# EAGLE design Bpod_RasPi_Shim_r1 (EAGLE 9.3.1)
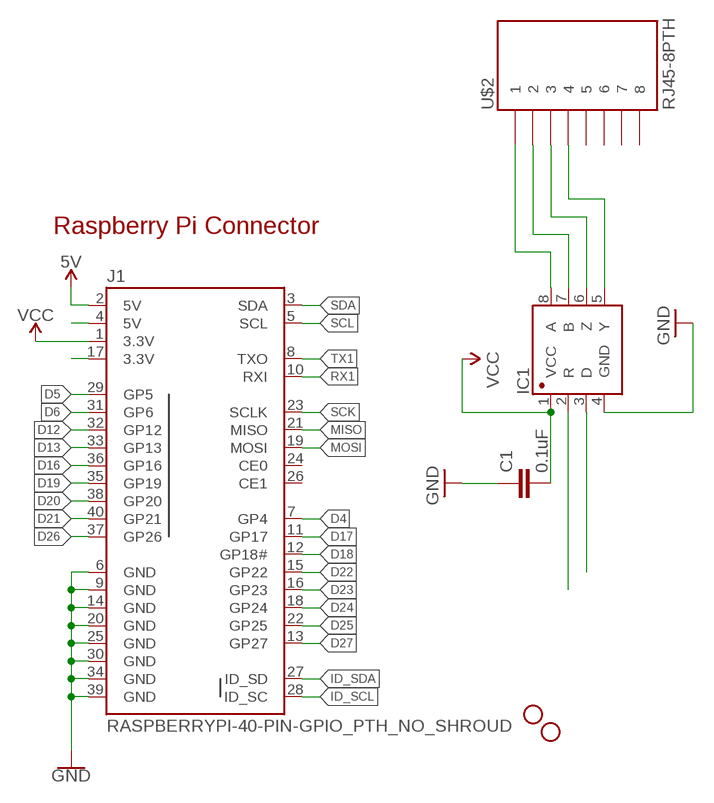
[diagram p0: schematic, sheet 1]

## Parts
C1  0.1uF  1.0UF-0805-25V-(+80/-20%)  [0805]
H3  STAND-OFFTIGHT  [STAND-OFF-TIGHT]
H4  STAND-OFFTIGHT  [STAND-OFF-TIGHT]
IC1  SN65HVD31DR  [SO08]
J1  RASPBERRYPI-40-PIN-GPIO_PTH_NO_SHROUD  [2X20]
U$2  RJ45-8PTH  [RJ45-8]

## Nets
5V: J1.2(5V)
D4: J1.7(GP4)
D5: J1.29(GP5)
D6: J1.31(GP6)
D12: J1.32(GP12)
D13: J1.33(GP13)
D16: J1.36(GP16)
D17: J1.11(GP17)
D18: J1.12(GP18#)
D19: J1.35(GP19)
D20: J1.38(GP20)
D21: J1.40(GP21)
D22: J1.15(GP22)
D23: J1.16(GP23)
D24: J1.18(GP24)
D25: J1.22(GP25)
D26: J1.37(GP26)
D27: J1.13(GP27)
GND [vcc]: C1.1 IC1.4(GND) J1.6(GND) J1.9(GND) J1.14(GND) J1.20(GND) J1.25(GND) J1.30(GND) J1.34(GND) J1.39(GND)
ID_SCL: J1.28(ID_SC)
ID_SDA: J1.27(ID_SD)
MISO: J1.21(MISO)
MOSI: J1.19(MOSI)
N$1: J1.17(3.3V)
N$3: J1.4(5V)
N$7: IC1.8(A) U$2.1
N$8: IC1.7(B) U$2.2
N$9: IC1.6(Z) U$2.3
N$10: IC1.5(Y) U$2.4
RX1: IC1.2(R) J1.10(RXI)
SCK: J1.23(SCLK)
SCL: J1.5(SCL)
SDA: J1.3(SDA)
TX1: IC1.3(D) J1.8(TXO)
VCC: C1.2 IC1.1(VCC) J1.1(3.3V)
Unconnected: J1.24(CE0) J1.26(CE1) U$2.5 U$2.6 U$2.7 U$2.8

## Notes on the sheet
- Raspberry Pi Connector

## Library data of the parts
C1 = SparkFun-Capacitors:1.0UF: 1µF ceramic capacitors A capacitor is a passive two-terminal electrical component used to store electrical energy temporarily in an electric field.; PROD_ID: CAP-11625; VALUE: 1.0uF
H3 H4 = SparkFun-Hardware:STAND-OFF: Stand Off Drill holes for mechanically mounting via screws, standoffs, etc. Note: Use the keepout ring to avoid running the screw head into surrounding components. Variant Overviews STAND-OFF - Mechanical footprint for a #4 phillips button head screw. STAND-OFF-TIGHT - Mechanical footprint for a #4 phillips button head screw, Example SparkFun Products Screw - Phillips Head (1/4", 4-40, 10 pack) <https://www.sparkfun.com/products/10453> (PRT-10453) Screw - Phillips Head (1/2", 4-40, 10 pack) <https://www.sparkfun.com/products/10452> (PRT-10452) Screw - Phillips Head (3/4", 4-40, 10 pack) <https://www.sparkfun.com/products/10451> (PRT-10451) Screw - Phillips Head (1", 4-40, 10 pack) <https://www.sparkfun.com/products/10450> (PRT-10450)
IC1 = Joshparts4:SN65HVD31DR: A placeholder for generic narrow & wide SOIC8 foorptints - used on the DIP adapter board.
J1 = SparkFun-Connectors:RASPBERRYPI-40-PIN-GPIO: Raspberry Pi GPIO Header 2x20 pin connector, as found on B, B+, A+ models. Both shrouded PTH and SMT versions available. SparkFun Products: GPIO Shrouded Header <https://www.sparkfun.com/products/13054>- PTH SparkFun Pi Wedge (Preassembled) <https://www.sparkfun.com/products/13717>
U$2 = SparkFun:RJ45-8: RJ45 Jack Simple RJ45, 8-pin connection - connector for common Cat5, Cat5e, and Cat6 Ethernet cables. Footprint not yet proven in production. Connector sku is PRT-00643; Breakout PCB sku is BOB-00716.

## Net classes
0 Default: width 0.178 mm
1 vcc: width 0.178 mm

## Board
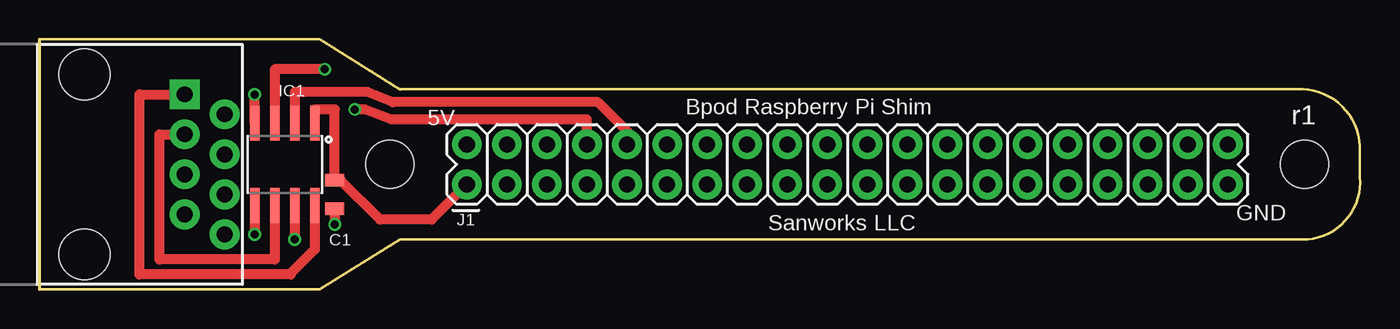
[diagram p1: board, top side]
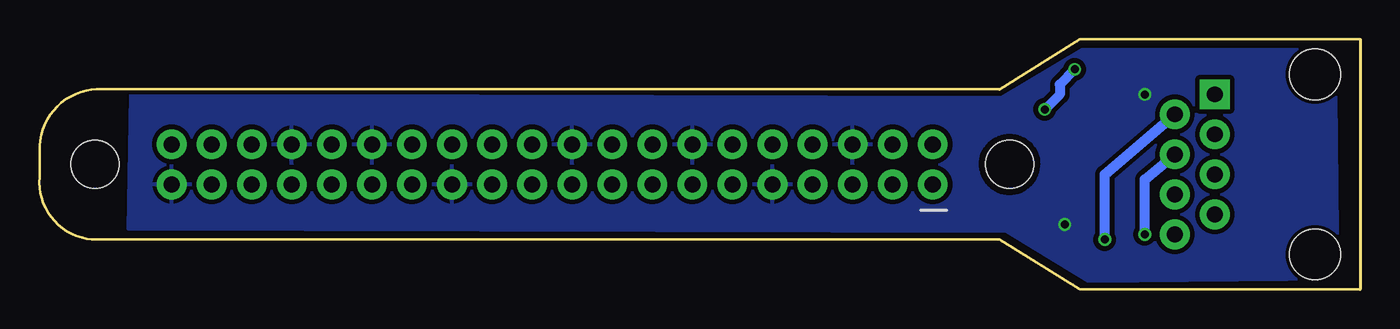
[diagram p2: board, bottom side, seen from below]

Size 83.75 x 15.88 mm. Coordinates in mm from the lower left corner, seen from the top.
Outline: 22.86,12.72 80.1,12.72 arc-90 83.73,8.77 83.73,7.13 arc-90 80.41,3.17 22.86,3.17 17.78,0 0,0 0,15.88 17.78,15.88 22.86,12.7
Copper layers (1*16): Top 0.035mm / dielectric 1.5mm / Bottom 0.035mm
Design rules "SeeedStudio_2layer_DRU_no_angle_20140221 *": minimum track width 6mil, minimum drill 12mil, track to track 12mil, track to pad 12mil, pad to pad 12mil, via to via 12mil, smd to smd 0mil, copper to edge 10mil, drill to drill 10mil, minimum pad ring 10mil, minimum via ring 6mil, stop-mask expansion 2mil, vias tented up to drill 100mil, thermal gap 10mil

### Footprints (pad centres in the part's own frame; a part is rotated, then mirrored left to right if it is on the bottom)
0805 = smd 0.8 x 1.2: 1 -0.9,0; 2 0.9,0
STAND-OFF-TIGHT = hole 3.048: 0,0
SO08 = smd 0.61 x 2.21: 1 -1.905,-2.616; 2 -0.635,-2.616; 3 0.635,-2.616; 4 1.905,-2.616; 5 1.905,2.616; 6 0.635,2.616; 7 -0.635,2.616; 8 -1.905,2.616
2X20 = drill 1.016 pad 1.88: 1 0,0; 2 0,2.54; 3 2.54,0; 4 2.54,2.54; 5 5.08,0; 6 5.08,2.54; 7 7.62,0; 8 7.62,2.54; 9 10.16,0; 10 10.16,2.54; 11 12.7,0; 12 12.7,2.54; 13 15.24,0; 14 15.24,2.54; 15 17.78,0; 16 17.78,2.54; 17 20.32,0; 18 20.32,2.54; 19 22.86,0; 20 22.86,2.54; 21 25.4,0; 22 25.4,2.54; 23 27.94,0; 24 27.94,2.54; 25 30.48,0; 26 30.48,2.54; 27 33.02,0; 28 33.02,2.54; 29 35.56,0; 30 35.56,2.54; 31 38.1,0; 32 38.1,2.54; 33 40.64,0; 34 40.64,2.54; 35 43.18,0; 36 43.18,2.54; 37 45.72,0; 38 45.72,2.54; 39 48.26,0; 40 48.26,2.54
RJ45-8 = drill 1 pad 1.88 square: 1 -4.445,6.35 | drill 1 pad 1.88: 2 -3.175,8.89; 3 -1.905,6.35; 4 -0.635,8.89; 5 0.635,6.35; 6 1.905,8.89; 7 3.175,6.35; 8 4.445,8.89 | hole 3.2: -5.715,0; 5.715,0

### Placement (x,y rotation side)
C1  18.73,6.03 90 top
H3  22.23,7.94 90 top
H4  80.23,7.94 90 top
IC1  15.56,7.94 180 top
J1  27.1,6.67 0 top
U$2  2.86,7.94 270 top

### Tracks (layer width: path | path; a pad name or v marks a point on that pad's centre or on a via)
GND  (via drill 0.51)
  Top 0.635: C1.1 v18.73,4.13 | IC1.4 v13.65,12.38
  pour Bottom: 77.94,12.38 22.7,12.22 17.62,15.24 1.58,15.24 1.43,0.63 17.2,0.48 22.38,3.65 78.11,3.81
N$7
  Top 0.635: IC1.8 17.46,2.54 15.91,0.99 15.95,0.95 6.35,0.95 6.35,12.38 U$2.1
N$8  (via drill 0.51)
  Top 0.635: IC1.7 v16.19,3.17
  Bottom 0.635: v16.19,3.17 16.19,7.3 U$2.2
N$9
  Top 0.635: IC1.6 14.92,1.9 7.62,1.9 7.62,9.84 U$2.3
N$10  (via drill 0.51)
  Top 0.635: IC1.5 v13.65,3.49
  Bottom 0.635: v13.65,3.49 13.65,6.98 U$2.4
RX1
  Top 0.635: J1.10 37.26,10.05 35.42,11.89 22.4,11.89 20.8,12.54 16.19,12.54 IC1.2
TX1  (via drill 0.51)
  Top 0.635: J1.8 34.72,10.8 22.33,10.8 20.64,11.43 v20,11.43 | v18.1,13.97 14.92,13.97 IC1.3
  Bottom 0.635: v20,11.43 19.05,12.38 19.05,13.02 v18.1,13.97
VCC
  Top 0.635: J1.1 24.88,4.45 21.59,4.45 19.1,6.93 C1.2 18.73,11.43 17.46,11.43 IC1.1

### Text on the board
tPlace: r1 | 5V | Bpod Raspberry Pi Shim | Sanworks LLC | GND